# Altium schematic sheet Main_Board.SchDoc (part 2 of 3)
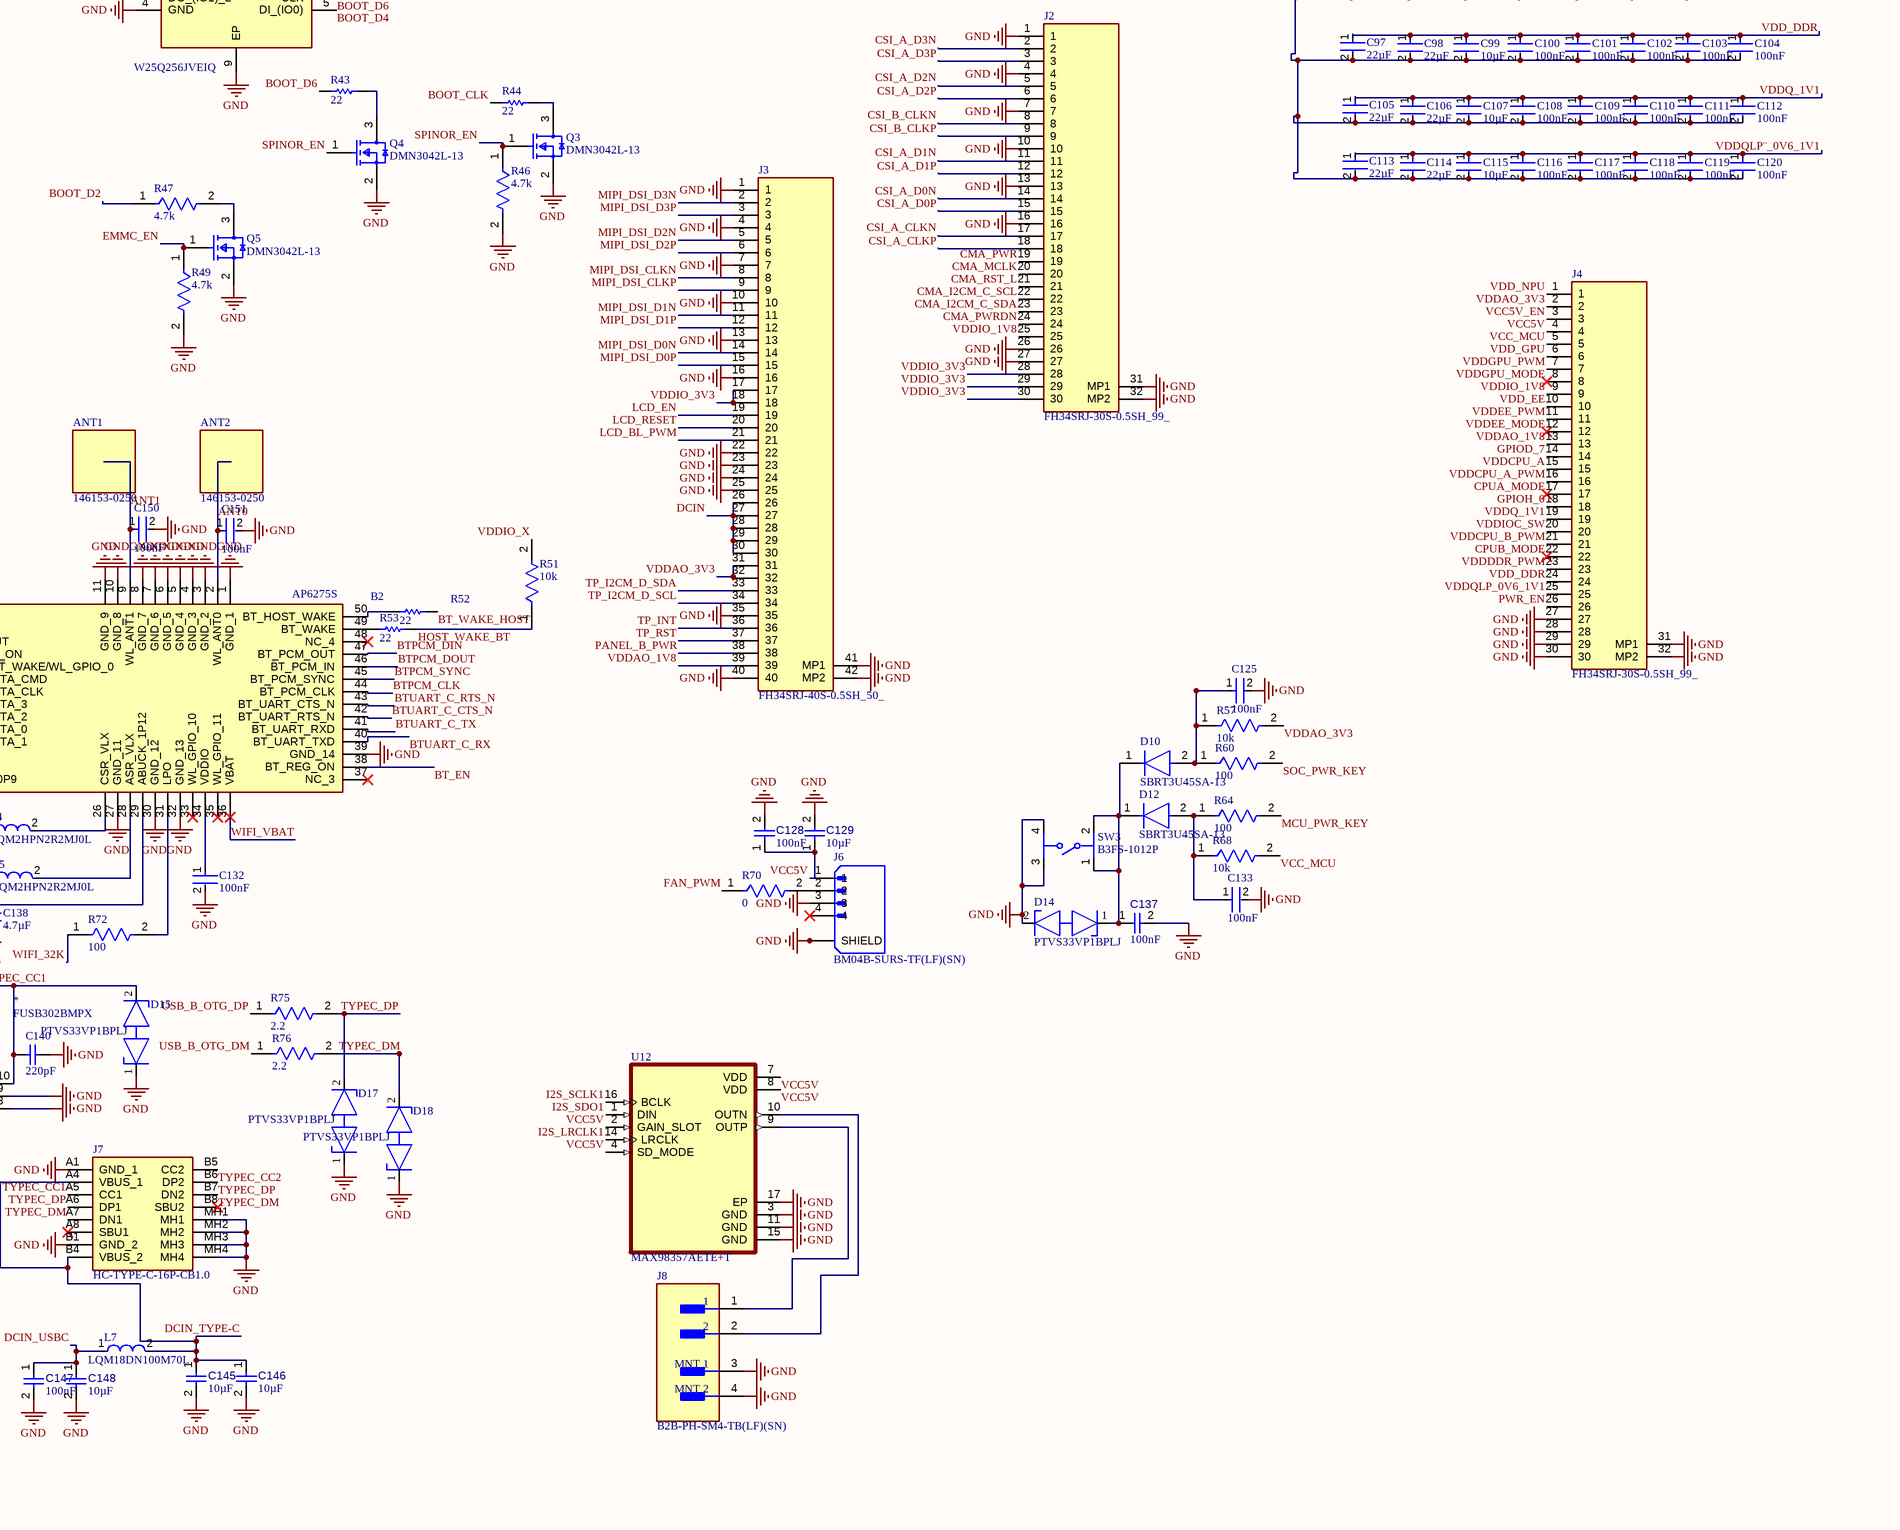
[diagram p6: Main_Board.SchDoc, bottom right]

## Nets
GND: *.8(GND_1) *.9(GND_2) *.15(EP_GND) B1.4(GND) B1.9(EP) B2.1(GND_1) B2.3(GND_2) B2.4(GND_3) B2.5(GND_4) B2.6(GND_5) B2.7(GND_6) B2.8(GND_7) B2.10(GND_8) B2.11(GND_9) B2.23(GND_10) B2.27(GND_11) B2.30(GND_12) B2.32(GND_13) B2.39(GND_14) C1.2 C2.2 C3.2 C4.2 C5.2 C6.2 C7.2 C8.2 C9.2 C10.2 C11.2 C12.1 C12.2 C13.2 C14.2 C15.2 C16.2 C17.2 C18.2 C19.2 C20.2 C21.2 C22.2 C23.2 C24.2 C25.2 C26.2 C27.2 C28.2 C29.2 C30.2 C31.2 C32.2 C33.2 C34.2 C35.2 C36.2 C37.2 C38.2 C39.2 C40.2 C41.2 C42.2 C43.2 C44.2 C45.2 C46.2 C47.2 C48.2 C49.2 C50.2 C51.2 C52.2 C53.2 C54.2 C55.2 C56.2 C57.2 C58.2 C59.2 C60.2 C61.2 C62.2 C63.2 C64.2 C65.2 C66.2 C67.2 C68.2 C69.2 C70.2 C71.2 C72.2 C73.2 C74.2 C75.2 C76.2 C77.2 C78.2 C79.2 C80.1 C81.2 C82.2 C83.2 C84.2 C85.2 C86.2 C87.2 C88.2 C89.2 C90.2 C91.2 C92.2 C93.2 C94.2 C95.2 C96.2 C97.2 C98.2 C99.2 C100.2 C101.2 C102.2 C103.2 C104.2 C105.2 C106.2 C107.2 C108.2 C109.2 C110.2 C111.2 C112.2 C113.2 C114.2 C115.2 C116.2 C117.2 C118.2 C119.2 C120.2 C121.2 C122.2 C123.2 C124.2 C125.2 C126.2 C127.2 C128.2 C129.2 C130.2 C131.2 C132.2 C133.2 C137.2 C138.2 C139.2 C140.2 C141.2 C142.2 C143.2 C144.2 C145.2 C146.2 C147.2 C148.2 C149.2 C150.2 C151.2 D11.1 D13.2 D14.2 D15.1 D16.1 D17.1 D18.1 J1.2 J1.3(MNT_1) J1.4(MNT_2) J2.1 J2.4 J2.7 J2.10 J2.13 J2.16 J2.26 J2.27 J2.31(MP1) J2.32(MP2) J3.1 J3.4 J3.7 J3.10 J3.13 J3.16 J3.22 J3.23 J3.24 J3.25 J3.35 J3.40 J3.41(MP1) J3.42(MP2) J4.27 J4.28 J4.29 J4.30 J4.31(MP1) J4.32(MP2) J5.3 J5.4 J5.MP1 J5.MP2 J6.3 J6.S1(SHIELD) J6.S2(SHIELD) J7.A1(GND_1) J7.B1(GND_2) J7.MH1 J7.MH2 J7.MH3 J7.MH4 J8.3(MNT_1) J8.4(MNT_2) Q3.2(S) Q4.2(S) Q5.2(S) Q6.2(S) R1.2 R4.1 R11.2 R16.2 R18.2 R21.2 R24.2 R25.1 R30.2 R32.2 R34.2 R38.2 R39.2 R40.2 R46.2 R49.2 R50.1 R55.2 R66.2 R67.1 R71.1 SW1.1(GND) SW1.A SW1.A' SW1.B' SW2.1(GND) SW2.A SW2.A' SW2.B' SW3.3 SW3.4 SW4.2 U1.A1(DVSS) U1.A5(DVSS) U1.A33(DVSS) U1.AA5(DVSS) U1.AA9(DVSS) U1.AA11(DVSS) U1.AA14(DVSS) U1.AA17(DVSS) U1.AA18(DVSS) U1.AA26(DVSS) U1.AB2(DVSS) U1.AB5(DVSS) U1.AB10(DVSS) U1.AB11(DVSS) U1.AB13(DVSS) U1.AB14(DVSS) U1.AB16(DVSS) U1.AB17(DVSS) U1.AB18(DVSS) U1.AB20(DVSS) U1.AB22(DVSS) U1.AB24(DVSS) U1.AB26(DVSS) U1.AB33(DVSS) U1.AC1(DVSS) U1.AC8(DVSS) U1.AC9(DVSS) U1.AC10(DVSS) U1.AC14(DVSS) U1.AC17(DVSS) U1.AC18(DVSS) U1.AC19(DVSS) U1.AC20(DVSS) U1.AC21(DVSS) U1.AC22(DVSS) U1.AC23(DVSS) U1.AC24(DVSS) U1.AC25(DVSS) U1.AC26(DVSS) U1.AC29(DVSS) U1.AD5(DVSS) U1.AD9(DVSS) U1.AD11(DVSS) U1.AD13(DVSS) U1.AD14(DVSS) U1.AD16(DVSS) U1.AD17(DVSS) U1.AD19(DVSS) U1.AD22(DVSS) U1.AD24(DVSS) U1.AD25(DVSS) U1.AE2(DVSS) U1.AE10(DVSS) U1.AE11(DVSS) U1.AE14(DVSS) U1.AE17(DVSS) U1.AE24(DVSS) U1.AE32(DVSS) U1.AF1(DVSS) U1.AF5(DVSS) U1.AF8(DVSS) U1.AF9(DVSS) U1.AF10(DVSS) U1.AF13(DVSS) U1.AF14(DVSS) U1.AF15(DVSS) U1.AF16(DVSS) U1.AF17(DVSS) U1.AF18(DVSS) U1.AF19(DVSS) U1.AF20(DVSS) U1.AF21(DVSS) U1.AF22(DVSS) U1.AF23(DVSS) U1.AF24(DVSS) U1.AF25(DVSS) U1.AF26(DVSS) U1.AF29(DVSS) U1.AG9(DVSS) U1.AG11(DVSS) U1.AG14(DVSS) U1.AG15(DVSS) U1.AG16(DVSS) U1.AG17(DVSS) U1.AG18(DVSS) U1.AG20(DVSS) U1.AG22(DVSS) U1.AG24(DVSS) U1.AG25(DVSS) U1.AG26(DVSS) U1.AH2(DVSS) U1.AH5(DVSS) U1.AH8(DVSS) U1.AH10(DVSS) U1.AH11(DVSS) U1.AH12(DVSS) U1.AH13(DVSS) U1.AH14(DVSS) U1.AH15(DVSS) U1.AH16(DVSS) U1.AH17(DVSS) U1.AH18(DVSS) U1.AH24(DVSS) U1.AH26(DVSS) U1.AJ1(DVSS) U1.AJ5(DVSS) U1.AJ8(DVSS) U1.AJ9(DVSS) U1.AJ10(DVSS) U1.AJ12(DVSS) U1.AJ16(DVSS) U1.AJ18(DVSS) U1.AJ19(DVSS) U1.AJ20(DVSS) U1.AJ22(DVSS) U1.AJ23(DVSS) U1.AJ24(DVSS) U1.AJ25(DVSS) U1.AJ29(DVSS) U1.AJ31(DVSS) U1.AK5(DVSS) U1.AK9(DVSS) U1.AK11(DVSS) U1.AK12(DVSS) U1.AK14(DVSS) U1.AK15(DVSS) U1.AK16(DVSS) U1.AK17(DVSS) U1.AK19(DVSS) U1.AK20(DVSS) U1.AK21(DVSS) U1.AK22(DVSS) U1.AK26(DVSS) U1.AL2(DVSS) U1.AL8(DVSS) U1.AL10(AVSS_DP) U1.AL12(DVSS) U1.AL13(DVSS) U1.AL14(DVSS) U1.AL15(DVSS) U1.AL18(DVSS) U1.AL20(DVSS) U1.AL21(DVSS) U1.AL22(DVSS) U1.AL23(DVSS) U1.AL24(DVSS) U1.AL26(DVSS) U1.AM2(DVSS) U1.AM5(DVSS) U1.AM8(DVSS) U1.AM9(DVSS) U1.AM11(DVSS) U1.AM26(DVSS) U1.AM29(DVSS) U1.AM31(DVSS) U1.AM33(DVSS) U1.AN5(DVSS) U1.AN9(DVSS) U1.AN13(DVSS) U1.AN16(DVSS) U1.AN17(DVSS) U1.AN19(DVSS) U1.AN22(DVSS) U1.AN25(DVSS) U1.AN26(DVSS) U1.AN29(DVSS) U1.AP2(DVSS) U1.AP10(DVSS) U1.AP31(DVSS) U1.AR10(DVSS) U1.AR13(DVSS) U1.AR16(DVSS) U1.AR19(DVSS) U1.AR22(DVSS) U1.AR25(DVSS) U1.AT3(DVSS) U1.AT9(DVSS) U1.AT12(DVSS) U1.AT20(DVSS) U1.AT28(DVSS) U1.AT31(DVSS) U1.AU1(DVSS) U1.AU5(DVSS) U1.AU7(DVSS) U1.AU10(DVSS) U1.AU33(DVSS) U1.B3(DVSS) U1.B6(DVSS) U1.B8(DVSS) U1.B11(DVSS) U1.B17(DVSS) U1.B23(DVSS) U1.B26(DVSS) U1.C2(DVSS) U1.C9(DVSS) U1.C11(DVSS) U1.C13(DVSS) U1.C16(DVSS) U1.C25(DVSS) U1.C29(DVSS) U1.D5(DVSS) U1.D11(DVSS) U1.D33(DVSS) U1.E1(DVSS) U1.E7(DVSS) U1.E9(DVSS) U1.E10(DVSS) U1.E13(DVSS) U1.E16(DVSS) U1.E19(DVSS) U1.E22(DVSS) U1.E25(DVSS) U1.E26(DVSS) U1.E29(DVSS) U1.F6(DVSS) U1.F23(DVSS) U1.F26(DVSS) U1.G2(DVSS) U1.G8(DVSS) U1.G10(DVSS) U1.G11(DVSS) U1.G13(DVSS) U1.G14(DVSS) U1.G15(DVSS) U1.G17(DVSS) U1.G19(DVSS) U1.G20(DVSS) U1.G22(DVSS) U1.G23(DVSS) U1.G24(DVSS) U1.G25(DVSS) U1.G26(DVSS) U1.H1(DVSS) U1.H5(DVSS) U1.H9(DVSS) U1.H11(DVSS) U1.H14(DVSS) U1.H17(DVSS) U1.H18(DVSS) U1.H19(DVSS) U1.H20(DVSS) U1.H23(DVSS) U1.H26(DVSS) U1.H29(DVSS) U1.J8(DVSS) U1.J9(DVSS) U1.J10(DVSS) U1.J13(DVSS) U1.J14(DVSS) U1.J16(DVSS) U1.J17(DVSS) U1.J18(DVSS) U1.J21(DVSS) U1.J22(DVSS) U1.J23(DVSS) U1.J24(DVSS) U1.J26(DVSS) U1.K2(DVSS) U1.K8(DVSS) U1.K10(DVSS) U1.K11(DVSS) U1.K14(DVSS) U1.K18(DVSS) U1.K22(DVSS) U1.K23(DVSS) U1.K25(DVSS) U1.K26(DVSS) U1.L1(DVSS) U1.L5(DVSS) U1.L9(DVSS) U1.L11(DVSS) U1.L13(DVSS) U1.L14(DVSS) U1.L16(DVSS) U1.L18(DVSS) U1.L19(DVSS) U1.L20(DVSS) U1.L21(DVSS) U1.L23(DVSS) U1.L24(DVSS) U1.L26(DVSS) U1.L29(DVSS) U1.L31(DVSS) U1.M8(DVSS) U1.M9(DVSS) U1.M10(DVSS) U1.M14(DVSS) U1.M17(DVSS) U1.M24(DVSS) U1.M26(DVSS) U1.N2(DVSS) U1.N6(DVSS) U1.N10(DVSS) U1.N11(DVSS) U1.N13(DVSS) U1.N14(DVSS) U1.N16(DVSS) U1.N17(DVSS) U1.N19(DVSS) U1.N21(DVSS) U1.N23(DVSS) U1.N24(DVSS) U1.N25(DVSS) U1.N26(DVSS) U1.P1(DVSS) U1.P5(DVSS) U1.P9(DVSS) U1.P11(DVSS) U1.P14(DVSS) U1.P17(DVSS) U1.P18(DVSS) U1.P19(DVSS) U1.P20(DVSS) U1.P21(DVSS) U1.P22(DVSS) U1.P23(DVSS) U1.P25(DVSS) U1.P26(DVSS) U1.P29(DVSS) U1.R5(DVSS) U1.R8(DVSS) U1.R9(DVSS) U1.R10(DVSS) U1.R13(DVSS) U1.R14(DVSS) U1.R16(DVSS) U1.R17(DVSS) U1.R24(DVSS) U1.R26(DVSS) U1.T2(DVSS) U1.T5(DVSS) U1.T8(DVSS) U1.T10(DVSS) U1.T11(DVSS) U1.T14(DVSS) U1.T17(DVSS) U1.T19(DVSS) U1.T21(DVSS) U1.T23(DVSS) U1.T24(DVSS) U1.T25(DVSS) U1.T26(DVSS) U1.U1(DVSS) U1.U9(DVSS) U1.U11(DVSS) U1.U12(DVSS) U1.U13(DVSS) U1.U14(DVSS) U1.U15(DVSS) U1.U16(DVSS) U1.U17(DVSS) U1.U18(DVSS) U1.U19(DVSS) U1.U20(DVSS) U1.U21(DVSS) U1.U22(DVSS) U1.U23(DVSS) U1.U24(DVSS) U1.U25(DVSS) U1.U29(DVSS) U1.U32(DVSS) U1.V6(DVSS) U1.V8(DVSS) U1.V9(DVSS) U1.V10(DVSS) U1.V12(DVSS) U1.V13(DVSS) U1.V15(DVSS) U1.V17(DVSS) U1.V18(DVSS) U1.V24(DVSS) U1.V26(DVSS) U1.W2(DVSS) U1.W10(DVSS) U1.W11(DVSS) U1.W12(DVSS) U1.W18(DVSS) U1.W20(DVSS) U1.W22(DVSS) U1.W24(DVSS) U1.W25(DVSS) U1.W26(DVSS) U1.W28(DVSS) U1.Y1(DVSS) U1.Y5(DVSS) U1.Y8(DVSS) U1.Y9(DVSS) U1.Y10(DVSS) U1.Y12(DVSS) U1.Y13(DVSS) U1.Y14(DVSS) U1.Y15(DVSS) U1.Y16(DVSS) U1.Y17(DVSS) U1.Y18(DVSS) U1.Y19(DVSS) U1.Y20(DVSS) U1.Y21(DVSS) U1.Y22(DVSS) U1.Y23(DVSS) U1.Y24(DVSS) U1.Y26(DVSS) U1.Y29(DVSS) U1.Y31(DVSS) U2.4(VSS) U3.5(VSS) U3.27(PB3) U3.29(PB5) U4.A3(VSS_1) U4.A10(VSS_2) U4.AB3(VSS_55) U4.AB5(VSS_56) U4.AB8(VSS_57) U4.AB10(VSS_58) U4.C1(VSS_3) U4.C5(VSS_4) U4.C8(VSS_5) U4.C12(VSS_6) U4.D2(VSS_7) U4.D4(VSS_8) U4.D9(VSS_9) U4.D11(VSS_10) U4.E1(VSS_11) U4.E5(VSS_12) U4.E8(VSS_13) U4.E12(VSS_14) U4.G1(VSS_15) U4.G3(VSS_16) U4.G5(VSS_17) U4.G8(VSS_18) U4.G10(VSS_19) U4.G12(VSS_20) U4.J1(VSS_21) U4.J3(VSS_22) U4.J10(VSS_23) U4.J12(VSS_24) U4.K2(VSS_25) U4.K4(VSS_26) U4.K9(VSS_27) U4.K11(VSS_28) U4.N2(VSS_29) U4.N4(VSS_30) U4.N9(VSS_31) U4.N11(VSS_32) U4.P1(VSS_33) U4.P3(VSS_34) U4.P10(VSS_35) U4.P12(VSS_36) U4.T1(VSS_37) U4.T3(VSS_38) U4.T5(VSS_39) U4.T8(VSS_40) U4.T10(VSS_41) U4.T12(VSS_42) U4.V1(VSS_43) U4.V5(VSS_44) U4.V8(VSS_45) U4.V12(VSS_46) U4.W2(VSS_47) U4.W4(VSS_48) U4.W9(VSS_49) U4.W11(VSS_50) U4.Y1(VSS_51) U4.Y5(VSS_52) U4.Y8(VSS_53) U4.Y12(VSS_54) U5.A6(VSS) U5.C4(VSS) U5.E7(VSS) U5.G5(VSS) U5.H10(VSS) U5.J5(VSS) U5.K8(VSS) U5.N2(VSS) U5.N5(VSS) U5.P4(VSS) U5.P6(VSS) U6.5(GND) U6.9(GND) U7.9(ST) U8.3(VSS) U9.3(VSS) U10.3(VSS) U11.3(VSS) U12.3(GND) U12.11(GND) U12.15(GND) U12.17(EP) U13.3(VSS) U14.3(VSS) U15.4(LR) U15.5(GND) U16.5(GND) U17.3(VSS) U18.3(VSS) U19.3(VSS) U20.3(VSS) U21.3(VSS) U22.3(VSS) U23.3(VSS) U24.3(VSS) U25.3(VSS) U26.3(VSS) X1.2(GND) X1.4(GND) Y2.2(GND) Y2.4(NC)
ADC_CH3: U1.AD29(SARADC_CH3)
ADC_CH6: U1.AD28(SARADC_CH6)
ADC_KEY: U1.AD30(SARADC_CH2)
ANT0: B2.2(WL_ANT0) C151.1
ANT1: B2.9(WL_ANT1) C150.1
AVDD0V8_CSI: U1.L22(AVDD0V8_CSI)
AVDD08_DP: U1.AJ13(AVDD08_DP) U1.AK13(AVDD08_DP)
AVDD18_DP: U1.AJ14(AVDD18_DP) U1.AJ15(AVDD18_DP)
BOOT_CLK: R44.1 U5.M6(CLK)
BOOT_CMD: R48.1 U1.AN23(GPIOB_10) U5.M5(CMD)
BOOT_D0: R45.2 U1.AP21(GPIOB_0) U5.A3(DAT0)
BOOT_D1: R21.1 U1.AP20(GPIOB_1) U5.A4(DAT1)
BOOT_D2: R24.1 R47.1 U1.AN21(GPIOB_2) U5.A5(DAT2)
BOOT_D3: U1.AM21(GPIOB_3) U5.B2(DAT3)
BOOT_D4: B1.5(DI_(IO0)) R16.1 U1.AR23(GPIOB_4) U5.B3(DAT4)
BOOT_D5: B1.2(DO_(IO1)_1) R18.1 U1.AP23(GPIOB_5) U5.B4(DAT5)
BOOT_D6: B1.6(CLK) B1.7(IO3) R42.1 R43.1 U1.AR24(GPIOB_6) U5.B5(DAT6)
BOOT_D7: B1.3(DO_(IO1)_2) U1.AP24(GPIOB_7) U5.B6(DAT7)
BOOT_DCLK: U1.AP26(GPIOB_8)
BOOT_DQS: R50.2 U1.AN24(GPIOB_11) U5.H5(DATA_STROBE)
BOOT_GPIOB_9: U1.AR26(GPIOB_9)
BOOT_GPIOB_12: U1.AM24(GPIOB_12)
BOOT_RST_N: U5.K5(RSTN)
BT_EN: B2.38(BT_REG_ON) U1.G21(GPIOX_17)
BT_WAKE_HOST: R52.2 U1.E17(GPIOX_18)
BTPCM_CLK: B2.44(BT_PCM_CLK) U1.B20(GPIOX_11)
BTPCM_DIN: B2.47(BT_PCM_OUT) U1.B19(GPIOX_9)
BTPCM_DOUT: B2.46(BT_PCM_IN) U1.A19(GPIOX_8)
BTPCM_SYNC: B2.45(BT_PCM_SYNC) U1.C19(GPIOX_10)
BTUART_C_CTS_N: B2.42(BT_UART_RTS_N) U1.E18(GPIOX_14)
BTUART_C_RTS_N: B2.43(BT_UART_CTS_N) U1.A18(GPIOX_15)
BTUART_C_RX: B2.40(BT_UART_TXD) U1.C18(GPIOX_13)
BTUART_C_TX: B2.41(BT_UART_RXD) U1.D18(GPIOX_12)
CMA_I2CM_C_SCL: J2.22 U1.E33(GPIOM_12)
CMA_I2CM_C_SDA: J2.23 U1.E32(GPIOM_13)
CMA_MCLK: C6.1 J2.20 L1.1
CMA_PWR: J2.19 U1.F32(GPIOM_10)
CMA_PWRDN: J2.24 U1.H32(GPIOM_5)
CMA_RST_L: J2.21 U1.E31(GPIOM_11)
CPU_RESET: C2.1 R3.2 R33.2 U1.F15(RESET_N)
CPU_RST_INT: R35.2 U3.14(PA7)
CPUA_MODE: J4.17
CPUB_MODE: J4.22
CSI_A_CLKN: J2.17 U1.A32(CSI_A_CLKN)
CSI_A_CLKP: J2.18 U1.A31(CSI_A_CLKP)
CSI_A_D0N: J2.14 U1.D32(CSI_A_D0N)
CSI_A_D0P: J2.15 U1.C32(CSI_A_D0P)
CSI_A_D1N: J2.11 U1.B32(CSI_A_D1N)
CSI_A_D1P: J2.12 U1.B33(CSI_A_D1P)
CSI_A_D2N: J2.5 U1.B31(CSI_A_D2N)
CSI_A_D2P: J2.6 U1.B30(CSI_A_D2P)
CSI_A_D3N: J2.2 U1.B29(CSI_A_D3N)
CSI_A_D3P: J2.3 U1.A29(CSI_A_D3P)
CSI_B_CLKN: J2.8 U1.A28(CSI_B_CLKN)
CSI_B_CLKP: J2.9 U1.B28(CSI_B_CLKP)
DCIN: C134.1 C135.1 C136.1 J3.26 J3.27 J3.28 J3.29 J3.30 R79.2 U7.8(OUT)
DCIN_TYPE-C: C145.1 C146.1 J7.A4(VBUS_1) J7.B4(VBUS_2) L7.2
DCIN_USBC: *.2(VBUS) C147.1 C148.1 D11.2 L7.1 R63.1 R65.1 U7.7(IN1)
DCIN_VIN: D13.1 J5.1 J5.2 R69.1 R73.1 R74.1 U7.2(IN2)
DDR1_CAA0: U1.AT1(DDR1_AC_11) U4.H2(CA0_A)
DDR1_CAA1: U1.AR1(DDR1_AC_10) U4.J2(CA1_A)
DDR1_CAA2: U1.AN2(DDR1_AC_8) U4.H9(CA2_A)
DDR1_CAA3: U1.AL3(DDR1_AC_9) U4.H10(CA3_A)
DDR1_CAA4: U1.AM3(DDR1_AC_13) U4.H11(CA4_A)
DDR1_CAA5: U1.AL4(DDR1_AC_12) U4.J11(CA5_A)
DDR1_CAB0: U1.AH1(DDR1_AC_33) U4.R2(CA0_B)
DDR1_CAB1: U1.AJ3(DDR1_AC_28) U4.P2(CA1_B)
DDR1_CAB2: U1.AG3(DDR1_AC_31) U4.R9(CA2_B)
DDR1_CAB3: U1.AE5(DDR1_AC_29) U4.R10(CA3_B)
DDR1_CAB4: U1.AG5(DDR1_AC_32) U4.R11(CA4_B)
DDR1_CAB5: U1.AG4(DDR1_AC_30) U4.P11(CA5_B)
DDR1_CKEA0: U1.AN3(DDR1_AC_0) U4.J4(CKE0_A)
DDR1_CKEA1: U1.AL5(DDR1_AC_1) U4.J5(CKE1_A)
DDR1_CKEB0: U1.AL1(DDR1_AC_20) U4.P4(CKE0_B)
DDR1_CKEB1: U1.AM1(DDR1_AC_21) U4.P5(CKE1_B)
DDR1_CLKA_C: U1.AK3(DDR1_AC_4) U4.J9(CK_C_A)
DDR1_CLKA_T: U1.AK4(DDR1_AC_5) U4.J8(CK_T_A)
DDR1_CLKB_C: U1.AH3(DDR1_AC_25) U4.P9(CK_C_B)
DDR1_CLKB_T: U1.AH4(DDR1_AC_24) U4.P8(CK_T_B)
DDR1_CSA0: U1.AP1(DDR1_AC_2) U4.H4(CS0_A)
DDR1_CSA1: U1.AP3(DDR1_AC_3) U4.H3(CS1_A)
DDR1_CSB0: U1.AK2(DDR1_AC_23) U4.R4(CS0_B)
DDR1_CSB1: U1.AJ2(DDR1_AC_22) U4.R3(CS1_B)
DDR1_DQ0: U1.AU2(DDR1_DQ0) U4.F2(DQ3_A)
DDR1_DQ1: U1.AP4(DDR1_DQ1) U4.E4(DQ5_A)
DDR1_DQ2: U1.AN6(DDR1_DQ2) U4.C4(DQ6_A)
DDR1_DQ3: U1.AP6(DDR1_DQ3) U4.B4(DQ7_A)
DDR1_DQ4: U1.AT5(DDR1_DQ4) U4.B2(DQ0_A)
DDR1_DQ5: U1.AU3(DDR1_DQ5) U4.E2(DQ2_A)
DDR1_DQ6: U1.AT4(DDR1_DQ6) U4.C2(DQ1_A)
DDR1_DQ7: U1.AR4(DDR1_DQ7) U4.F4(DQ4_A)
DDR1_DQ8: U1.AU9(DDR1_DQ8) U4.C9(DQ14_A)
DDR1_DQ9: U1.AR8(DDR1_DQ9) U4.E9(DQ13_A)
DDR1_DQ10: U1.AR9(DDR1_DQ10) U4.B9(DQ15_A)
DDR1_DQ11: U1.AT10(DDR1_DQ11) U4.C11(DQ9_A)
DDR1_DQ12: U1.AR7(DDR1_DQ12) U4.F9(DQ12_A)
DDR1_DQ13: U1.AP8(DDR1_DQ13) U4.E11(DQ10_A)
DDR1_DQ14: U1.AN8(DDR1_DQ14) U4.F11(DQ11_A)
DDR1_DQ15: U1.AT11(DDR1_DQ15) U4.B11(DQ8_A)
DDR1_DQ16: U1.AE4(DDR1_DQ16) U4.U2(DQ3_B)
DDR1_DQ17: U1.AF2(DDR1_DQ17) U4.V4(DQ5_B)
DDR1_DQ18: U1.AG2(DDR1_DQ18) U4.U4(DQ4_B)
DDR1_DQ19: U1.AE1(DDR1_DQ19) U4.Y2(DQ1_B)
DDR1_DQ20: U1.AC3(DDR1_DQ20) U4.AA4(DQ7_B)
DDR1_DQ21: U1.AD2(DDR1_DQ21) U4.AA2(DQ0_B)
DDR1_DQ22: U1.AE3(DDR1_DQ22) U4.V2(DQ2_B)
DDR1_DQ23: U1.AC2(DDR1_DQ23) U4.Y4(DQ6_B)
DDR1_DQ24: U1.AB1(DDR1_DQ24) U4.U9(DQ12_B)
DDR1_DQ25: U1.AA3(DDR1_DQ25) U4.U11(DQ11_B)
DDR1_DQ26: U1.AA4(DDR1_DQ26) U4.V11(DQ10_B)
DDR1_DQ27: U1.AA2(DDR1_DQ27) U4.V9(DQ13_B)
DDR1_DQ28: U1.Y3(DDR1_DQ28) U4.AA9(DQ15_B)
DDR1_DQ29: U1.W4(DDR1_DQ29) U4.AA11(DQ8_B)
DDR1_DQ30: U1.W5(DDR1_DQ30) U4.Y11(DQ9_B)
DDR1_DQ31: U1.W3(DDR0_DQ31) U1.Y2(DDR1_DQ31) U4.Y9(DQ14_B)
DDR1_DQM0: U1.AR6(DDR1_DQM0) U4.C3(DMI0_A)
DDR1_DQM1: U1.AP7(DDR1_DQM1) U4.C10(DMI1_A)
DDR1_DQM2: U1.AF3(DDR1_DQM2) U4.Y3(DMI0_B)
DDR1_DQM3: U1.W1(DDR1_DQM3) U4.Y10(DMI1_B)
DDR1_DQSN0: U1.AT6(DDR1_DQSN0) U4.E3(DQS0_C_A)
DDR1_DQSN1: U1.AT7(DDR1_DQSP1) U4.E10(DQS1_C_A)
DDR1_DQSN2: U1.AD3(DDR1_DQSN2) U4.V3(DQS0_C_B)
DDR1_DQSN3: U1.AB3(DDR1_DQSN3) U4.V10(DQS1_C_B)
DDR1_DQSP0: U1.AU6(DDR1_DQSP0) U4.D3(DQS0_T_A)
DDR1_DQSP1: U1.AT8(DDR1_DQSN1) U4.D10(DQS1_T_A)
DDR1_DQSP2: U1.AD4(DDR1_DQSP2) U4.W3(DQS0_T_B)
DDR1_DQSP3: U1.AB4(DDR1_DQSP3) U4.W10(DQS1_T_B)
DDR1_PVREF: C149.1 U1.AK6(DDR1_PVREF)
DDR1_PZQ: U1.AN7(DDR1_PZQ)
DDR1_RST: U1.AL6(DDR1_RST) U4.T11(RESET_N)
DDR_ID: U1.AD31(SARADC_CH0)
DMIC_VDD: C141.1 C142.1 C143.1 C144.1 L6.2 U15.2(VDD) U16.2(VDD) U16.4(LR)
DRAM1_VDD1_1V8: C71.1 C72.1 C73.1 C74.1 C75.1 C76.1 C77.1 C78.1
DRAM_VDD1_1V8: U4.F1(VDD1_1) U4.F12(VDD1_2) U4.G4(VDD1_3) U4.G9(VDD1_4) U4.T4(VDD1_5) U4.T9(VDD1_6) U4.U1(VDD1_7) U4.U12(VDD1_8)
EMMC_EN: Q5.1(G) R49.1 U3.11(PA4)
ENET_EXTRES: R11.1 U1.AB28(ENET_EXTRES)
EVCC3V3: C124.1 U6.7(OUT)
FAN_PWM: R70.1 U3.19(PA9) U10.1(VDD)
GPIOD_5/IR_IN: U1.B13(GPIOD_5)
GPIOD_7: J4.14 U1.E12(GPIOD_7)
GPIOH_0: J4.18 U1.R28(GPIOH_0)
GPIOT_18: U1.N28(GPIOT_18) U11.4(DIN)
HOST_WAKE_BT: R51.1 R53.2 U1.D17(GPIOX_19)
HW_ID: R19.1 R25.2 U1.AE29(SARADC_CH1)
I2CM_AO_SCL: R23.1 R77.2 U1.F11(GPIOD_2) U2.6(SCL) U3.30(PB6)
I2CM_AO_SDA: R20.1 R78.2 U1.E14(GPIOD_3) U2.5(SDA) U3.31(PB7)
I2S_LRCLK1: U1.N29(GPIOT_2) U12.14(LRCLK)
I2S_MCLK1: U1.P32(GPIOT_0)
I2S_SCLK1: U1.P33(GPIOT_1) U12.16(BCLK)
I2S_SDI1: U1.P31(GPIOT_4)
I2S_SDO1: U1.N33(GPIOT_3) U12.1(DIN)
LCD_BL_PWM: J3.21 U1.AM14(GPIOY_1)
LCD_EN: J3.19 U1.AN14(GPIOY_2)
LCD_RESET: J3.20 U1.AR21(GPIOY_9)
MCU_BOOT_CTRL: Q2.1(G) R39.1
MCU_I2C2_SCL: U3.22(PA11[PA9])
MCU_I2C2_SDA: U3.23(PA12[PA10])
MCU_NMI: R31.1 U3.16(PB1)
MCU_PA0: U3.7(PA0)
MCU_PA15: U3.26(PA15)
MCU_PWR_CTRL: D6.2(A) R34.1 U3.15(PB0)
MCU_PWR_KEY: R26.2 R64.2 U3.28(PB4)
MCU_RST: C47.1 Q1.3(D) R27.1 U3.6(PF2-NRST)
MCU_RST_CTRL: Q1.1(G) U1.J29(GPIOT_12)
MCU_SWCLK: Q2.2(S) R40.1 U3.25(PA14-BOOT0)
MCU_SWDIO: U3.24(PA13)
MCU_USART2_RX: U3.10(PA3)
MCU_USART2_TX: U3.9(PA2)
MIPI_DSI_CLKN: J3.8 U1.AU19(VX1_A_2N)
MIPI_DSI_CLKP: J3.9 U1.AT19(VX1_A_2P)
MIPI_DSI_D0N: J3.14 U1.AM18(VX1_A_0N)
MIPI_DSI_D0P: J3.15 U1.AN18(VX1_A_0P)
MIPI_DSI_D1N: J3.11 U1.AR18(VX1_A_1N)
MIPI_DSI_D1P: J3.12 U1.AP18(VX1_A_1P)
MIPI_DSI_D2N: J3.5 U1.AR17(VX1_A_3N)
MIPI_DSI_D2P: J3.6 U1.AP17(VX1_A_3P)
MIPI_DSI_D3N: J3.2 U1.AU18(VX1_A_4N)
MIPI_DSI_D3P: J3.3 U1.AT18(VX1_A_4P)
PANEL_B_PWR: J3.38 U1.AU22(GPIOY_10)
PDM_DCLK: U1.J32(GPIOM_3) U15.3(CLOCK) U16.3(CLOCK)
PDM_DIN3: SW4.3(1_C) U1.J30(GPIOM_2)
POR_OUT: R3.1 U1.E23(POR_OUT)
PWR_EN: J4.26 R58.1
PWR_HOLD: D5.2(A) R30.1
PWR_HOLD_EXT: D9.2(A) R38.1
RGMII_CRS_DV: U1.AA31(GPIOZ_4)
RGMII_MDC: U1.AB30(GPIOZ_1)
RGMII_MDIO: U1.AB29(GPIOZ_0)
RGMII_RXCLK: U1.AB31(GPIOZ_2)
RTC_CLK: R15.2 U2.7(CLKOUT)
RTC_INT: R14.1 U2.3(~{INT}) U3.17(PB2)
SDIO_CLK: R5.2 U1.A21(GPIOX_4)
SDPWR_EN: U1.A13(GPIOD_11)
SOC_PWR_KEY: R22.2 R60.2 U1.B14(GPIOD_4)
SPDIF_OUT: U1.E11(GPIOD_8)
SPIF_CS: B1.1(/CS) R41.1
SPINOR_EN: Q3.1(G) Q4.1(G) R46.1 U3.8(PA1)
SYS_LED: U1.D12(GPIOD_6)
TP_I2CM_D_SCL: J3.34 U1.G33(GPIOM_6)
TP_I2CM_D_SDA: J3.33 U1.G32(GPIOM_7)
TP_INT: J3.36 U1.E27(GPIOM_8)
TP_RST: J3.37 U1.D27(GPIOM_9)
TYPEC_CC1: *.10(CC1_1) *.11(CC1_2) C140.1 D15.2 J7.A5(CC1)
TYPEC_CC2: *.1(CC2_1) *.14(CC2_2) C139.1 D16.2 J7.B5(CC2)
TYPEC_DM: D18.2 J7.A7(DN1) J7.B7(DN2) R76.2
TYPEC_DP: D17.2 J7.A6(DP1) J7.B6(DP2) R75.2
USB_B_OTG_DM: R76.1 U1.C28(USB_B_OTG_DM)
USB_B_OTG_DP: R75.1 U1.D28(USB_B_OTG_DP)
USBCC_INTn: *.5(INT_N) U1.AM20(GPIOY_4)
VCC5V: *.12(VCONN_1) *.13(VCONN_2) C128.1 C129.1 J4.4 J6.1 U8.1(VDD) U9.1(VDD) U11.1(VDD) U12.2(GAIN_SLOT) U12.4(SD_MODE) U12.7(VDD) U12.8(VDD) U13.1(VDD) U14.1(VDD) U17.1(VDD) U18.1(VDD) U19.1(VDD) U20.1(VDD) U21.1(VDD) U22.1(VDD) U23.1(VDD) U24.1(VDD) U25.1(VDD) U26.1(VDD)
VCC5V_EN: J4.3 U1.R32(GPIOH_4)
VCC_MCU: C122.1 D1.2(A) J4.5 Q2.3(D) R14.2 R27.2 R28.2 R59.1 R68.2 U3.4(VDD) U6.8(IN1)
VDD_DDR: C97.1 C98.1 C99.1 C100.1 C101.1 C102.1 C103.1 C104.1 J4.24 U1.AA10(VDD_DDR) U1.AC11(VDD_DDR) U1.AD10(VDD_DDR) U1.AE8(AVDD_DDR1PLL) U1.AF11(VDD_DDR) U1.AG10(VDD_DDR) U1.AJ11(VDD_DDR) U1.AK10(VDD_DDR) U1.H10(VDD_DDR) U1.J11(VDD_DDR) U1.L10(VDD_DDR) U1.M11(VDD_DDR) U1.P10(VDD_DDR) U1.R11(VDD_DDR) U1.U10(VDD_DDR) U1.V11(VDD_DDR) U1.Y11(VDD_DDR)
VDD_EE: C16.1 C17.1 C18.1 C19.1 C20.1 C21.1 C22.1 J4.10 U1.AD18(VDD_EE) U1.AD20(VDD_EE) U1.AE18(VDD_EE) U1.AE19(VDD_EE) U1.AE20(VDD_EE) U1.AG19(VDD_EE) U1.AG21(VDD_EE) U1.AG23(VDD_EE) U1.AH19(VDD_EE) U1.AH20(VDD_EE) U1.AH21(VDD_EE) U1.AH22(VDD_EE) U1.AH23(VDD_EE) U1.J19(VDD_EE) U1.J20(VDD_EE) U1.K19(VDD_EE) U1.K20(VDD_EE) U1.K21(VDD_EE) U1.V14(VDD_EE) U1.V16(VDD_EE) U1.W13(VDD_EE) U1.W14(VDD_EE) U1.W15(VDD_EE) U1.W16(VDD_EE) U1.W17(VDD_EE)
VDD_GPU: C32.1 C33.1 C34.1 C35.1 C36.1 C37.1 C38.1 C39.1 J4.6 U1.M18(VDD_GPU) U1.M19(VDD_GPU) U1.M20(VDD_GPU) U1.M21(VDD_GPU) U1.M22(VDD_GPU) U1.M23(VDD_GPU) U1.N18(VDD_GPU) U1.N20(VDD_GPU) U1.N22(VDD_GPU) U1.P24(VDD_GPU) U1.R18(VDD_GPU) U1.R19(VDD_GPU) U1.R20(VDD_GPU) U1.R21(VDD_GPU) U1.R22(VDD_GPU) U1.R23(VDD_GPU) U1.T18(VDD_GPU) U1.T20(VDD_GPU) U1.T22(VDD_GPU)
VDD_NPU: C41.1 C42.1 C43.1 C44.1 C45.1 C46.1 C48.1 C49.1 C50.1 C51.1 C52.1 C53.1 C54.1 J4.1 U1.AA19(VDD_NPU) U1.AA20(VDD_NPU) U1.AA21(VDD_NPU) U1.AA22(VDD_NPU) U1.AA23(VDD_NPU) U1.AA24(VDD_NPU) U1.AB19(VDD_NPU) U1.AB21(VDD_NPU) U1.AB23(VDD_NPU) U1.AD21(VDD_NPU) U1.AD23(VDD_NPU) U1.AE21(VDD_NPU) U1.AE22(VDD_NPU) U1.AE23(VDD_NPU) U1.V19(VDD_NPU) U1.V20(VDD_NPU) U1.V21(VDD_NPU) U1.V22(VDD_NPU) U1.V23(VDD_NPU) U1.W19(VDD_NPU) U1.W21(VDD_NPU) U1.W23(VDD_NPU)
VDDAO_1V8: C4.1 C5.1 C7.1 C8.1 C10.1 C11.1 C13.1 J3.39 J4.13 L3.2 L6.1 R19.2 U1.AB25(AVDD18_ENET) U1.AK18(VDD18_AO) U1.AL11(AVDD18_DDR_DP_PLL) U1.G16(VDD18_AO) U1.H16(VDDIO_E) U1.H25(AVDD18_MCLK) U1.K17(AVDD18_PLL) U1.M25(AVDD18_CSI) U1.Y25(AVDD18_SARADC)
VDDAO_3V3: *.3(VDD_1) *.4(VDD_2) C1.1 C123.1 J3.31 J3.32 J4.2 R2.1 R15.1 R17.2 R20.2 R23.2 R29.2 R36.1 R37.2 R57.2 U1.F9(VDDIO_D) U6.6(IN2)
VDDAO_3V3_POR: C3.1 U1.F20(AVDD33_POR)
VDDCPU_A: C24.1 C25.1 C26.1 C27.1 C28.1 C29.1 C30.1 C31.1 C55.1 C56.1 C57.1 C58.1 C59.1 C60.1 C61.1 C62.1 J4.15 U1.G12(VDDCPU_A) U1.H12(VDDCPU_A) U1.H13(VDDCPU_A) U1.H15(VDDCPU_A) U1.J12(VDDCPU_A) U1.J15(VDDCPU_A) U1.K12(VDDCPU_A) U1.K13(VDDCPU_A) U1.K15(VDDCPU_A) U1.K16(VDDCPU_A) U1.L12(VDDCPU_A) U1.L15(VDDCPU_A) U1.M12(VDDCPU_A) U1.M13(VDDCPU_A) U1.M15(VDDCPU_A) U1.M16(VDDCPU_A) U1.N12(VDDCPU_A) U1.P12(VDDCPU_A) U1.P13(VDDCPU_A) U1.P15(VDDCPU_A) U1.P16(VDDCPU_A) U1.R12(VDDCPU_A) U1.R15(VDDCPU_A) U1.T12(VDDCPU_A) U1.T13(VDDCPU_A) U1.T15(VDDCPU_A) U1.T16(VDDCPU_A)
VDDCPU_A_PWM: J4.16 U1.C14(GPIOE_3)
VDDCPU_B: C63.1 C64.1 C65.1 C66.1 C67.1 C68.1 C69.1 C70.1 U1.AA12(VDDCPU_B) U1.AA13(VDDCPU_B) U1.AA15(VDDCPU_B) U1.AA16(VDDCPU_B) U1.AB12(VDDCPU_B) U1.AB15(VDDCPU_B) U1.AC12(VDDCPU_B) U1.AC13(VDDCPU_B) U1.AC15(VDDCPU_B) U1.AC16(VDDCPU_B) U1.AD12(VDDCPU_B) U1.AD15(VDDCPU_B) U1.AE12(VDDCPU_B) U1.AE13(VDDCPU_B) U1.AE15(VDDCPU_B) U1.AE16(VDDCPU_B) U1.AF12(VDDCPU_B) U1.AG12(VDDCPU_B) U1.AG13(VDDCPU_B)
VDDCPU_B_EN: R2.2 U1.F14(TEST_N)
VDDCPU_B_PWM: J4.21 U1.E15(GPIOE_1)
VDDDDR_PWM: J4.23 U1.F17(GPIOE_6)
VDDEE_MODE: J4.12
VDDEE_PWM: J4.11 U1.C17(GPIOE_0)
VDDGPU_MODE: J4.8
VDDGPU_PWM: J4.7 U1.C15(GPIOE_4)
VDDIO_1V8: J2.25 J4.9 L2.2
VDDIO_3V3: J2.28 J2.29 J2.30 J3.17 J3.18 U1.AJ17(VDDIO_Y) U1.R25(VDDIO_T) U5.C6(VDD) U5.M4(VDD) U5.N4(VDD) U5.P3(VDD) U5.P5(VDD)
VDDIO_BOOT: B1.8(VCC) C80.2 R41.2 R42.2 R45.1 R48.2 U5.E6(VDDF) U5.F5(VDDF) U5.J10(VDDF) U5.K9(VDDF)
VDDIO_H: U1.V25(VDDIO_H)
VDDIO_LX: R61.1 R62.1
VDDIO_M: L2.1 L3.1 U1.L25(VDDIO_M)
VDDIO_X: R51.2 U1.G18(VDDIO_X)
VDDIO_Z: U1.T28(VDDIO_Z)
VDDIOC_SW: J4.20 U1.C12(GPIOD_9) U1.U26(VDDIO_C)
VDDNPU_PWM: U1.F18(GPIOE_5)
VDDQ_1V1: C81.1 C82.1 C83.1 C84.1 C85.1 C86.1 C87.1 C88.1 C105.1 C106.1 C107.1 C108.1 C109.1 C110.1 C111.1 C112.1 J4.19 U4.A4(VDD2_1) U4.A9(VDD2_2) U4.AB4(VDD2_23) U4.F5(VDD2_3) U4.F8(VDD2_4) U4.G2(ODT_CA_A) U4.H1(VDD2_5) U4.H5(VDD2_6) U4.H8(VDD2_7) U4.H12(VDD2_8) U4.K1(VDD2_9) U4.K3(VDD2_10) U4.K10(VDD2_11) U4.K12(VDD2_12) U4.N1(VDD2_13) U4.N3(VDD2_14) U4.N10(VDD2_15) U4.N12(VDD2_16) U4.R1(VDD2_17) U4.R5(VDD2_18) U4.R8(VDD2_19) U4.R12(VDD2_20) U4.T2(ODT_CA_B) U4.U5(VDD2_21) U4.U8(VDD2_22)
VDDQ_VDDQLP_EN: U1.D14(GPIOD_10)
VDDQLP_0V6_1V1: J4.25 U1.AA8(VDDQ) U1.AB8(VDDQLP) U1.AB9(VDDQ) U1.AC5(VDDQLP) U1.AD6(VDDQLP) U1.AD8(VDDQ) U1.AE9(VDDQ) U1.AG8(VDDQ) U1.AH9(VDDQ) U1.AK8(VDDQ) U1.AL9(VDDQ) U1.G9(VDDQ) U1.H8(VDDQ) U1.K9(VDDQ) U1.L8(VDDQ) U1.M6(VDDQLP) U1.N9(VDDQ) U1.P8(VDDQ) U1.T6(VDDQLP) U1.T9(VDDQ) U1.U5(VDDQLP) U1.U8(VDDQ) U1.W8(VDDQLP) U1.W9(VDDQLP)
VDDQLP¨_0V6_1V1: C89.1 C90.1 C91.1 C92.1 C93.1 C94.1 C95.1 C96.1 C113.1 C114.1 C115.1 C116.1 C117.1 C118.1 C119.1 C120.1
VDQLP_0V6_1V1: U4.A5(ZQ0) U4.A8(ZQ1) U4.AA3(VDDQ_17) U4.AA5(VDDQ_18) U4.AA8(VDDQ_19) U4.AA10(VDDQ_20) U4.B3(VDDQ_1) U4.B5(VDDQ_2) U4.B8(VDDQ_3) U4.B10(VDDQ_4) U4.D1(VDDQ_5) U4.D5(VDDQ_6) U4.D8(VDDQ_7) U4.D12(VDDQ_8) U4.F3(VDDQ_9) U4.F10(VDDQ_10) U4.U3(VDDQ_11) U4.U10(VDDQ_12) U4.W1(VDDQ_13) U4.W5(VDDQ_14) U4.W8(VDDQ_15) U4.W12(VDDQ_16)
VVDDAO_3V3_POR: R36.2
WD_RSTO: R29.1 R31.2 U1.F12(GPIOD_12)
WIFI_32K: R72.1 U1.B18(GPIOX_16)
WIFI_PWREN: B2.15(WL_REG_ON) U1.E20(GPIOX_6)
WIFI_SD_CLK: B2.18(SDIO_DATA_CLK) R5.1
WIFI_SD_CMD: B2.17(SDIO_DATA_CMD) R61.2 U1.B21(GPIOX_5)
WIFI_SD_D0: B2.21(SDIO_DATA_0) R62.2 U1.D21(GPIOX_0)
WIFI_SD_D1: B2.22(SDIO_DATA_1) U1.E21(GPIOX_1)
WIFI_SD_D2: B2.20(SDIO_DATA_2) U1.C21(GPIOX_2)
WIFI_SD_D3: B2.19(SDIO_DATA_3) U1.D20(GPIOX_3)
WIFI_VBAT: B2.36(VBAT)
WIFI_WAKE_HOST: R56.1 U1.C20(GPIOX_7)
WOL_EN: U3.13(PA6) U6.2(D0)
WOL_INTB: U3.12(PA5)
Net*_6: *.6(SCL) R77.1
Net*_7: *.7(SDA) R78.1
NetB2_13: B2.13(XTAL_IN) C126.1 Y2.1
NetB2_14: B2.14(XTAL_OUT) R54.2
NetB2_16: B2.16(WL_HOST_WAKE/WL_GPIO_0) R56.2
NetB2_25: B2.25(CBUCK_0P9) C130.1 L4.1
NetB2_26: B2.26(CSR_VLX) L4.2
NetB2_28: B2.28(ASR_VLX) L5.2
NetB2_29: B2.29(ABUCK_1P12) C138.1 L5.1
NetB2_31: B2.31(LPO) R72.2
NetB2_34: B2.34(VDDIO) C132.1
NetB2_49: B2.49(BT_WAKE) R53.1
NetB2_50: B2.50(BT_HOST_WAKE) R52.1
NetC9_1: C9.1 R6.1 X1.1(X1)
NetC14_1: C14.1 U2.1(OSCI) Y1.2
NetC15_1: C15.1 U2.2(OSCO) Y1.1
NetC23_1: C23.1 D3.2(A) R17.1 R22.1
NetC40_1: C40.1 D4.2(A) R26.1 R28.1
NetC79_1: C79.1 D8.2(A) R35.1 R37.1
NetC121_1: C121.1 U5.C2(VDDI)
NetC125_1: C125.1 D10.2(A) R57.1 R60.1
NetC127_1: C127.1 R54.1 Y2.3
NetC131_1: C131.1 U7.11(SS)
NetC133_1: C133.1 D12.2(A) R64.1 R68.1
NetC134_2: C134.2 C135.2 C136.2 U7.12(GND)
NetC137_1: C137.1 D10.1(C) D12.1(C) D14.1 SW3.1 SW3.2
NetD1_1: D1.1(C) D2.1(C) U2.8(VDD)
NetD2_2: D2.2(A) J1.1
NetD3_1: D3.1(C) D4.1(C) SW1.B
NetD5_1: D5.1(C) D6.1(C) D9.1(C)
NetD7_1: D7.1(C) D8.1(C) SW2.B
NetD7_2: D7.2(A) R33.1
NetJ6_2: J6.2 R70.2
NetJ8_1: J8.1 U12.9(OUTP)
NetJ8_2: J8.2 U12.10(OUTN)
NetL1_2: L1.2 U1.A27(CM_MCLK1)
NetQ1_2: Q1.2(S) R32.1
NetQ3_3: Q3.3(D) R44.2
NetQ4_3: Q4.3(D) R43.2
NetQ5_3: Q5.3(D) R47.2
NetQ6_1: Q6.1(G) R58.2
NetQ6_3: Q6.3(D) R59.2 U6.3(D1)
NetR1_1: R1.1 U1.B15(GPIOD_1)
NetR4_2: R4.2 U1.A15(GPIOD_0)
NetR6_2: R6.2 U1.B16(SYS_OSCOUT)
NetR55_1: R55.1 U6.4(ILIM)
NetR63_2: R63.2 U7.6(PR1)
NetR65_2: R65.2 R67.2 U7.5(~{OV1})
NetR66_1: R66.1 U7.10(ILM)
NetR69_2: R69.2 R71.2 U7.4(~{OV2})
NetR73_2: R73.2 R74.2 U7.3(CP2)
NetR79_1: R79.1 U7.1(OUT)
NetSW4_1: SW4.1 U15.1(DATA) U16.1(DATA)
NetU1_A16: U1.A16(SYS_OSCIN) X1.3(X2)
NetU8_2: U8.2(DOUT) U14.4(DIN)
NetU8_4: U8.4(DIN) U9.2(DOUT)
NetU9_4: U9.4(DIN) U10.2(DOUT)
NetU10_4: U10.4(DIN) U11.2(DOUT)
NetU13_2: U13.2(DOUT) U18.4(DIN)
NetU13_4: U13.4(DIN) U14.2(DOUT)
NetU17_2: U17.2(DOUT) U20.4(DIN)
NetU17_4: U17.4(DIN) U18.2(DOUT)
NetU19_2: U19.2(DOUT) U22.4(DIN)
NetU19_4: U19.4(DIN) U20.2(DOUT)
NetU21_2: U21.2(DOUT) U24.4(DIN)
NetU21_4: U21.4(DIN) U22.2(DOUT)
NetU23_2: U23.2(DOUT) U26.4(DIN)
NetU23_4: U23.4(DIN) U24.2(DOUT)
NetU25_4: U25.4(DIN) U26.2(DOUT)

Not connected (* = marked no-connect by the designer): B2 12(NC_1)* 24(NC_2)* 33(WL_GPIO_10)* 35(WL_GPIO_11)* 37(NC_3)* 48(NC_4)*; J6 4*; J7 A8(SBU1)* B8(SBU2)*; SW4 4* 5* 6* 7(2_C)* 8*; U1 A2(DDR0_DQ0)* A3(DDR0_DQ5)* A6(DDR0_DQ7)* A7(DDR0_DQSP0)* A9(DDR0_DQSP1)* A10(DDR0_DQ11)* A12(DDR0_DQ15)* A22(USB20_TXRTUNE)* A24(USB30_TXN)* A25(USB30_RXP)* AA6(DDR1_AC_36)* AA25(ENET_ATP)* AA28(GPIOZ_7)* AA29(GPIOZ_5)* AA30(GPIOZ_3)* AA32(ENET_RXP)* AB6(DDR1_AC_37)* AB32(ENET_RXN)* AC31(AU_AIL1)* AC32(AU_AIL2)* AC33(AU_AIR1)* AD26(AU_VMID)* AD32(AU_AIR2)* AE6(DDR1_AC_34)* AE25(AVDD18_AUDIO)* AE26(AVSS_AUDIO)* AE28(AU_REFP)* AE30(AU_LO1L)* AE31(AU_LO1R)* AE33(GPIOW_14)* AF31(GPIOW_13)* AF32(GPIOW_12)* AF33(GPIOW_4)* AG6(DDR1_AC_35)* AG28(GPIOW_3)* AG29(GPIOW_2)* AG30(GPIOW_9)* AG31(GPIOW_8)* AG32(GPIOW_15)* AH6(DDR1_AC_15)* AH25(AVDD18_HDMITX_EARCRX)* AH28(GPIOW_0)* AH29(GPIOW_10)* AH30(GPIOW_11)* AH31(GPIOW_16)* AH32(GPIOW_7)* AH33(GPIOW_6)* AJ21(AVDD33_HDMITX)* AJ26(AVSS_HPLL)* AJ32(HDMITX_D2P)* AJ33(HDMITX_REXT)* AK23(AVDD08_HDMIRX)* AK24(AVDD33_HDMIRX)* AK25(AVDD18_HDMIRX_EARCTX) AK28(HDMITX_ARCRXP)* AK29(HDMITX_ARCRXN)* AK30(HDMIRX_C_D2N)* AK31(HDMIRX_C_D2P)* AK32(HDMITX_D2N) AL16(VX1_LPP)* AL17(VX1_LPN)* AL19(VX1_ATP)* AL25(AVDD08_HDMITX)* AL28(HDMIRX_C_D0N)* AL29(HDMIRX_C_D0P)* AL30(HDMIRX_C_D1N)* AL31(HDMIRX_C_D1P)* AL32(HDMITX_D1P)* AL33(HDMITX_D1N)* AM12(VX1_B_4P)* AM15(VX1_A_5N)* AM17(GPIOY_0)* AM23(VDDIO_B) AM32(HDMITX_D0P)* AN4(DDR1_AC_6)* AN10(VX1_B_7P)* AN11(VX1_B_7N)* AN12(VX1_B_4N)* AN15(VX1_A_5P)* AN20(GPIOY_3)* AN27(GPIOW_1)* AN28(GPIOW_5)* AN30(HDMIRX_C_CLKN)* AN31(HDMIRX_C_CLKP)* AN32(HDMITX_D0N)* AP11(VX1_B_6N)* AP12(VX1_B_5N)* AP14(VX1_B_1P)* AP15(VX1_A_7P)* AP27(HDMIRX_ARCTXN)* AP28(HDMIRX_B_CLKP)* AP29(HDMIRX_B_D0N)* AP30(HDMIRX_B_D0P)* AP32(HDMITX_CLKP)* AP33(HDMITX_CLKN)* AR2(DDR1_AC_7)* AR3(DDR1_AC_26)* AR11(VX1_B_6P)* AR12(VX1_B_5P)* AR14(VX1_B_1N)* AR15(VX1_A_7N)* AR20(GPIOY_8)* AR27(HDMIRX_ARCTXP)* AR28(HDMIRX_B_CLKN)* AR30(HDMIRX_B_D1N)* AR31(HDMIRX_B_D1P)* AR32(HDMIRX_B_D2P)* AR33(HDMIRX_A_D2P) AT2(DDR1_AC_14)* AT13(VX1_B_3N)* AT14(VX1_B_2P)* AT15(VX1_B_2N)* AT16(VX1_A_6P)* AT17(VX1_A_6N)* AT21(GPIOY_5)* AT22(GPIOY_7)* AT23(GPIOY_11)* AT24(GPIOY_12)* AT25(GPIOY_13)* AT26(GPIOY_14)* AT27(GPIOY_18)* AT29(HDMIRX_A_D0N)* AT30(HDMIRX_A_D0P)* AT32(HDMIRX_B_D2N)* AT33(HDMIRX_A_D2N)* AU12(DIF_REXT)* AU13(VX1_B_3P)* AU15(VX1_B_0P)* AU16(VX1_B_0N)* AU21(GPIOY_6)* AU24(GPIOY_16)* AU25(GPIOY_15)* AU27(GPIOY_17)* AU28(HDMIRX_A_CLKN)* AU29(HDMIRX_A_CLKP)* AU31(HDMIRX_A_D1N)* AU32(HDMIRX_A_D1P)* B1(DDR0_AC_8)* B2(DDR0_AC_9)* B4(DDR0_DQ1)* B5(DDR0_DQM0)* B7(DDR0_DQSN0)* B9(DDR0_DQSN1)* B10(DDR0_DQ14)* B12(DDR0_DQ8)* B22(USB30_PCIE_REXT)* B24(USB30_TXP)* B25(USB30_RXN)* B27(CM_MCLK2)* C3(DDR0_AC_7)* C4(DDR0_AC_14)* C6(DDR0_DQ3)* C7(DDR0_DQ6)* C8(DDR0_DQM1)* C10(DDR0_DQ13)* C22(HCSL_REXT)* C23(PCIE_CLK_N)* C24(PCIE_RXN)* C26(USB_A_OTG_DP)* C27(USB_A_OTG_DM)* C30(CSI_D_CLKP)* C31(CSI_D_CLKN)* D1(DDR0_AC_12)* D2(DDR0_AC_13)* D3(DDR0_AC_10)* D4(DDR0_RST)* D6(DDR0_DQ2)* D7(DDR0_DQ4)* D8(DDR0_DQ9)* D10(DDR0_DQ12)* D15(GPIOE_2)* D23(PCIE_CLK_P)* D24(PCIE_RXP)* D26(USB_B_OTG_ID)* D30(CSI_C_D3P)* D31(CSI_C_D3N)* E2(DDR0_AC_0)* E3(DDR0_AC_15)* E5(DDR0_AC_35)* E8(DDR0_DQ10)* E24(PCIE_TXN)* F2(DDR0_AC_1)* F3(DDR0_AC_5)* F4(DDR0_AC_11)* F5(DDR0_AC_34)* F8(DDR0_PZQ)* F21(USB_A_OTG_VBUS)* F24(PCIE_TXP)* F28(CSI_C_D2P)* F29(CSI_C_D2N)* F30(CSI_C_CLKP)* F31(CSI_C_CLKN)* G1(DDR0_AC_2)* G3(DDR0_AC_4)* G4(DDR0_AC_24)* G5(DDR0_AC_25)* G6(DDR0_PVREF)* G28(CSI_C_D0N)* G29(CSI_C_D0P)* G30(CSI_C_D1P)* G31(CSI_C_D1N)* H2(DDR0_AC_31)* H3(DDR0_AC_3)* H21(USB_A_OTG_ID)* H22(AVDD0V8_USB_PCIE)* H24(AVDD33_USB)* H31(GPIOM_1)* H33(GPIOM_4)* J2(DDR0_AC_29)* J3(DDR0_AC_33)* J4(DDR0_AC_6)* J5(DDR0_AC_26)* J6(DDR0_AC_36)* J25(AVDD18_USB_PCIE)* J28(GPIOT_15)* J31(GPIOM_0)* K1(DDR0_AC_30)* K3(DDR0_AC_21)* K4(DDR0_AC_20)* K5(DDR0_AC_28)* K6(DDR0_AC_38)* K24(USB_B_OTG_VBUS)* K28(GPIOT_16)* K29(GPIOT_17)* K30(GPIOT_5)* K31(GPIOT_8)* K32(GPIOT_11)* K33(GPIOT_7)* L2(DDR0_DQM2)* L3(DDR0_AC_32)* L17(AVSS_PLL)* L32(GPIOT_19)* L33(GPIOT_6)* M2(DDR0_DQ20)* M3(DDR0_DQ17)* M4(DDR0_AC_22)* M5(DDR0_AC_23)* M28(GPIOT_13)* M29(GPIOT_14)* M30(GPIOT_20)* M31(GPIOT_21)* M32(GPIOT_9)* N1(DDR0_DQ21)* N3(DDR0_DQ16)* N4(DDR0_DQ19)* N5(DDR0_DQ23)* N8(AVDD_DDR0PLL)* N15(VDDCPU_A) N30(GPIOT_23)* N31(GPIOT_22)* N32(GPIOT_10)* P2(DDR0_DQ22)* P3(DDR0_DQ18)* R2(DDR0_DQ24)* R3(DDR0_DQSP2)* R4(DDR0_DQSN2)* R6(DDR0_AC_37)* R29(GPIOH_1)* R30(GPIOH_2)* R31(GPIOH_3)* T1(DDR0_DQ27)* T3(DDR0_DQSP3)* T4(DDR0_DQSN3)* T29(GPIOH_5)* T30(GPIOH_6) T31(GPIOH_7)* T32(GPIOC_2)* T33(GPIOC_3)* U2(DDR0_DQ25)* U3(DDR0_DQ26)* U31(GPIOC_5)* U33(GPIOC_4)* V2(DDR0_DQM3)* V3(DDR0_DQ30)* V4(DDR0_DQ29)* V5(DDR0_DQ28)* V28(GPIOZ_6)* V29(GPIOZ_13)* V30(GPIOZ_11)* V31(GPIOZ_12)* V32(GPIOC_0)* W6(DDR1_AC_38)* W29(GPIOZ_8)* W30(GPIOZ_9)* W31(GPIOZ_10)* W32(GPIOC_1)* W33(GPIOC_6)* Y32(ENET_TXN)* Y33(ENET_TXP)*; U3 1(PB9)* 2(PC14-OSC32_IN)* 3(PC15-OSC32_OUT)* 18(PA8)* 20(PC6)* 21(PA10)* 32(PB8)*; U4 A1(DNU_1)* A2(DNU_2)* A11(DNU_3)* A12(DNU_4)* AA1(DNU_7)* AA12(DNU_8)* AB1(DNU_9)* AB2(DNU_10)* AB9(VDD2_24) AB11(DNU_11)* AB12(DNU_12)* B1(DNU_5)* B12(DNU_6) G11(NC_1)* K5(NC_2)* K8(NC_3)* N5(NC_4)* N8(NC_5)*; U6 1(STAT)*; U25 2(DOUT)*

## Notes on the sheet
- Labels drawn without touching a wire or pin: GND, VDDQ_1V1
- DWG. NO.
- REV.
- SHT.
- REVISION
- DESCRIPTION
- DATE
- APPROVED
- THIS DOCUMENT AND THE DATA DISCLOSED HEREIN OR HEREWITH IS THE PROPERTY OF ALTIUM LIMITED AND MAY BE FREELY DISTRIBUTED IN WHOLE. NO RIGHTS ARE RESERVED OR EXPRESS OR IMPLIED WARANTEE GIVEN.
- ENG:
- DSN:
- APPROVALS
- PROJECT
- DOCUMENT REVISION:
- DESIGN ITEM:
- CHK:
- BOM:
- REFERENCE DOCUMENTS
- PROJECT REVISION:
- TITLE
- FAB DWG:
- PCB DWG:
- ASSY DWG:
- SCALE:
- SIZE
- C
- CAGE CODE
- FILE NAME
- DWG NO.
- SHEET
- OF
- REV